# Altium schematic sheet PRUC-Voltmeter_Top.SchDoc: Voltmeter / Top
size A4; SheetNumber: 2; SheetTotal: 9
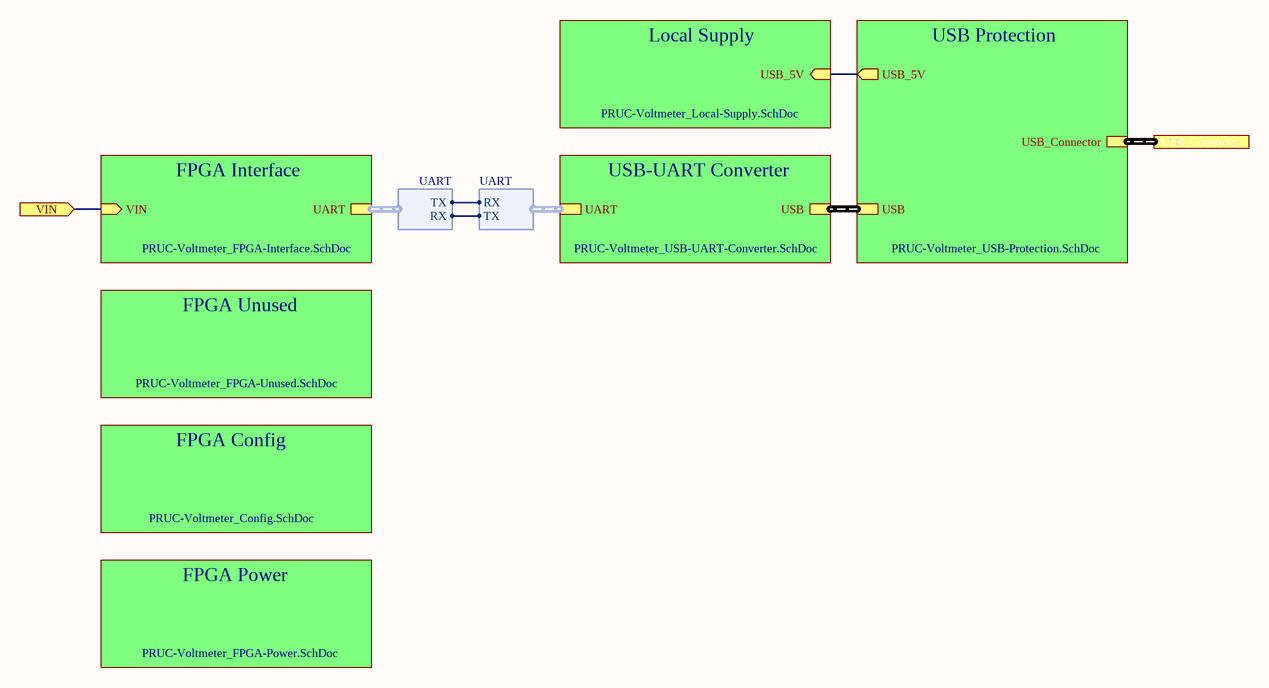
[diagram p0: PRUC-Voltmeter_Top.SchDoc]

## Sub-sheets
FPGA Config = PRUC-Voltmeter_Config.SchDoc: no entries
FPGA Interface = PRUC-Voltmeter_FPGA-Interface.SchDoc: VIN (in), UART (harness UART)
FPGA Power = PRUC-Voltmeter_FPGA-Power.SchDoc: no entries
FPGA Unused = PRUC-Voltmeter_FPGA-Unused.SchDoc: no entries
Local Supply = PRUC-Voltmeter_Local-Supply.SchDoc: USB_5V (in)
USB Protection = PRUC-Voltmeter_USB-Protection.SchDoc: USB_Connector (harness USB_HOST), USB_5V (out), USB (harness USB)
USB-UART Converter = PRUC-Voltmeter_USB-UART-Converter.SchDoc: USB (harness USB), UART (harness UART)

## Ports
USB_Connector (harness USB_HOST), VIN (in)

## Harnesses
UART: TX, RX

## Nets
VIN: port VIN, sheet FPGA Interface/VIN
(unnamed): sheet Local Supply/USB_5V, sheet USB Protection/USB_5V
(unnamed): sheet USB-UART Converter/UART.TX, sheet FPGA Interface/UART.RX
(unnamed): sheet USB-UART Converter/UART.RX, sheet FPGA Interface/UART.TX

## Buses and harness runs
harness port USB_Connector = sheet USB Protection/USB_Connector
harness sheet USB Protection/USB = sheet USB-UART Converter/USB

## Notes on the sheet
- Project:
- Title:
- Variant Name:
- Author:
- Checked by:
- Ver/Rev:
- Date:
- Approved by:
- Sheet:
- of
- File name: